# EAGLE design euro_psu (EAGLE 8.3.2)
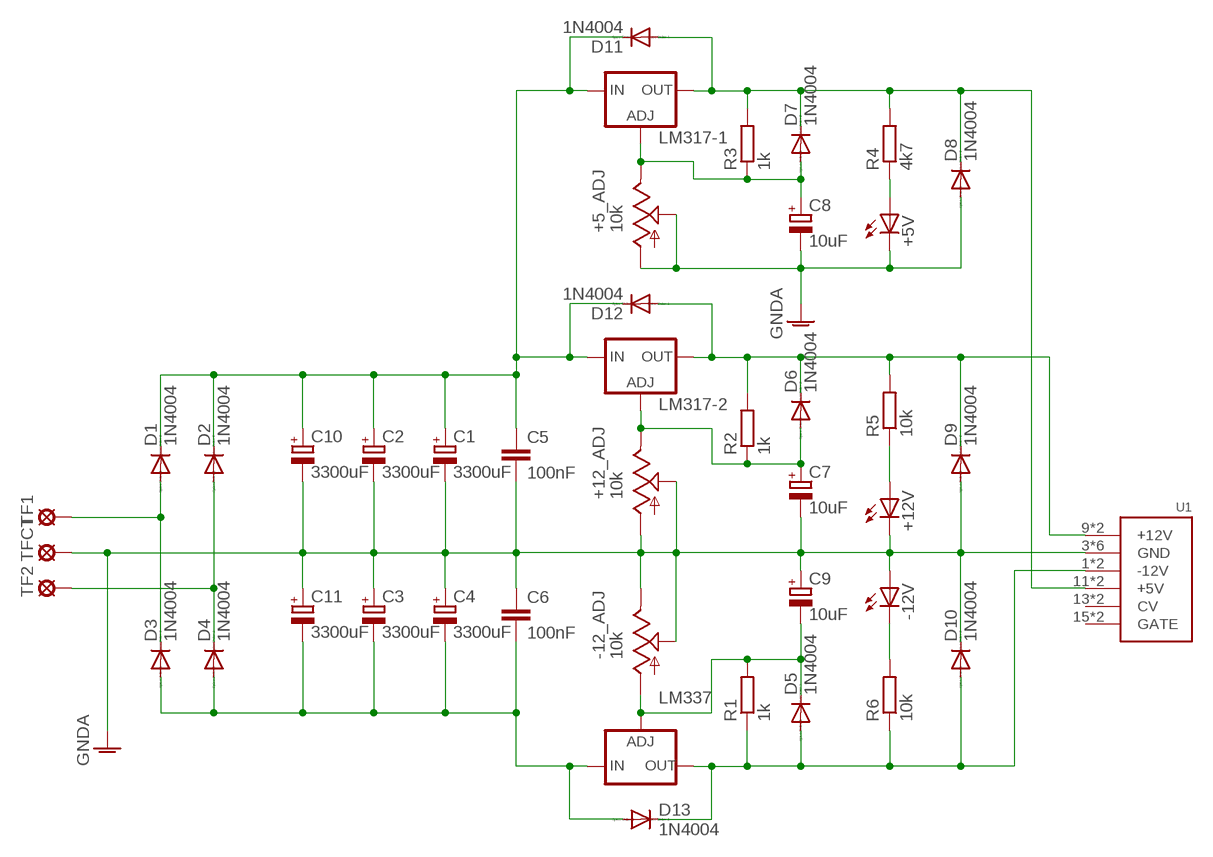
[diagram p0: schematic, sheet 1]

## Parts
+5_ADJ  10k  TRIM_US-B64W  [B64W]
+5V  LED5MM  [LED5MM]
+12_ADJ  10k  TRIM_US-B64W  [B64W]
+12V  LED5MM  [LED5MM]
-12_ADJ  10k  TRIM_US-B64W  [B64W]
-12V  LED5MM  [LED5MM]
C1  3300uF  CPOL-EUE7.5-16  [E7,5-16]
C2  3300uF  CPOL-EUE7.5-16  [E7,5-16]
C3  3300uF  CPOL-EUE7.5-16  [E7,5-16]
C4  3300uF  CPOL-EUE7.5-16  [E7,5-16]
C5  100nF  C-EU025-025X050  [C025-025X050]
C6  100nF  C-EU025-025X050  [C025-025X050]
C7  10uF  CPOL-EUB45181A  [B45181A]
C8  10uF  CPOL-EUB45181A  [B45181A]
C9  10uF  CPOL-EUB45181A  [B45181A]
C10  3300uF  CPOL-EUE7.5-16  [E7,5-16]
C11  3300uF  CPOL-EUE7.5-16  [E7,5-16]
D1  1N4004  [DO41-10]
D2  1N4004  [DO41-10]
D3  1N4004  [DO41-10]
D4  1N4004  [DO41-10]
D5  1N4004  [DO41-10]
D6  1N4004  [DO41-10]
D7  1N4004  [DO41-10]
D8  1N4004  [DO41-10]
D9  1N4004  [DO41-10]
D10  1N4004  [DO41-10]
D11  1N4004  [DO41-10]
D12  1N4004  [DO41-10]
D13  1N4004  [DO41-10]
LM317-1  LM317TS  [317TS]
LM317-2  LM317TS  [317TS]
LM337  LM337TS  [337TS]
R1  1k  R-EU_0207/10  [0207/10]
R2  1k  R-EU_0207/10  [0207/10]
R3  1k  R-EU_0207/10  [0207/10]
R4  4k7  R-EU_0207/10  [0207/10]
R5  10k  R-EU_0207/10  [0207/10]
R6  10k  R-EU_0207/10  [0207/10]
TF1  SE14  [SE14]
TF2  SE14  [SE14]
TFCT  SE14  [SE14]
U1  POWER  [POWER_16]

## Nets
GNDA: +5_ADJ.A +5_ADJ.P$1(S) +5_ADJ.S +5V.K(C) +12_ADJ.A +12_ADJ.P$1(S) +12_ADJ.S +12V.K(C) -12_ADJ.E -12_ADJ.P$1(S) -12_ADJ.S -12V.A C1.- C2.- C3.+ C4.+ C5.2 C6.1 C7.- C8.- C9.+ C10.- C11.+ D8.A D9.A D10.C TFCT.MP U1.3(GND) U1.4(GND) U1.5(GND) U1.6(GND) U1.7(GND) U1.8(GND)
N$1: D1.A D3.C TF1.MP
N$2: D2.A D4.C TF2.MP
N$3: C3.- C4.- C6.2 C11.- D3.A D4.A D13.A LM337.2(IN)
N$4: C1.+ C2.+ C5.1 C10.+ D1.C D2.C D11.C D12.C LM317-1.3(IN) LM317-2.3(IN)
N$5: -12_ADJ.A C9.- D5.C LM337.1(ADJ) R1.2
N$6: +12_ADJ.E C7.+ D6.A LM317-2.1(ADJ) R2.1
N$8: +5_ADJ.E C8.+ D7.A LM317-1.1(ADJ) R3.1
N$10: D5.A D10.A D13.C LM337.3(OUT) R1.1 R6.1 U1.1(-12V) U1.2(-12V)
N$11: D6.C D9.C D12.A LM317-2.2(OUT) R2.2 R5.2 U1.9(+12V) U1.10(+12V)
N$12: D7.C D8.C D11.A LM317-1.2(OUT) R3.2 R4.2 U1.11(+5V) U1.12(+5V)
N$21: +5V.A R4.1
N$24: -12V.K(C) R6.2
N$25: +12V.A R5.1
Unconnected: U1.13(CV) U1.14(CV) U1.15(GATE) U1.16(GATE)

## Library data of the parts
+5_ADJ +12_ADJ -12_ADJ = pot:TRIM_US-: POTENTIOMETER
+5V +12V -12V = led:LED: LED OSRAM: - CHIPLED LG R971, LG N971, LY N971, LG Q971, LY Q971, LO R971, LY R971 LH N974, LH R974 LS Q976, LO Q976, LY Q976 LO Q996 - Hyper CHIPLED LW Q18S LB Q993, LB Q99A, LB R99A - SideLED LS A670, LO A670, LY A670, LG A670, LP A670 LB A673, LV A673, LT A673, LW A673 LH A674 LY A675 LS A676, LA A676, LO A676, LY A676, LW A676 LS A679, LY A679, LG A679 - Hyper Micro SIDELED® LS Y876, LA Y876, LO Y876, LY Y876 LT Y87S - SmartLED LW L88C, LW L88S LB L89C, LB L89S, LG L890 LS L89K, LO L89K, LY L89K LS L896, LA L896, LO L896, LY L896 - TOPLED LS T670, LO T670, LY T670, LG T670, LP T670 LSG T670, LSP T670, LSY T670, LOP T670, LYG T670 LG T671, LOG T671, LSG T671 LB T673, LV T673, LT T673, LW T673 LH T674 LS T676, LA T676, LO T676, LY T676, LB T676, LH T676, LSB T676, LW T676 LB T67C, LV T67C, LT T67C, LS T67K, LO T67K, LY T67K, LW E67C LS E67B, LA E67B, LO E67B, LY E67B, LB E67C, LV E67C, LT E67C LW T67C LS T679, LY T679, LG T679 LS T770, LO T770, LY T770, LG T770, LP T770 LB T773, LV T773, LT T773, LW T773 LH T774 LS E675, LA E675, LY E675, LS T675 LS T776, LA T776, LO T776, LY T776, LB T776 LHGB T686 LT T68C, LB T68C - Hyper Mini TOPLED® LB M676 - Mini TOPLED Santana® LG M470 LS M47K, LO M47K, LY M47K Source: http://www.osram.convergy.de LUXEON: - LUMILED® LXK2-PW12-R00, LXK2-PW12-S00, LXK2-PW14-U00, LXK2-PW14-V00 LXK2-PM12-R00, LXK2-PM12-S00, LXK2-PM14-U00 LXK2-PE12-Q00, LXK2-PE12-R00, LXK2-PE12-S00, LXK2-PE14-T00, LXK2-PE14-U00 LXK2-PB12-K00, LXK2-PB12-L00, LXK2-PB12-M00, LXK2-PB14-N00, LXK2-PB14-P00, LXK2-PB14-Q00 LXK2-PR12-L00, LXK2-PR12-M00, LXK2-PR14-Q00, LXK2-PR14-R00 LXK2-PD12-Q00, LXK2-PD12-R00, LXK2-PD12-S00 LXK2-PH12-R00, LXK2-PH12-S00 LXK2-PL12-P00, LXK2-PL12-Q00, LXK2-PL12-R00 Source: www.luxeon.com KINGBRIGHT: KA-3528ASYC Source: www.kingbright.com
C1-C4 C7-C11 = rcl:CPOL-EU: POLARIZED CAPACITOR, European symbol
C5 C6 = rcl:C-EU: CAPACITOR, European symbol
D1-D13 = diode:1N4004: DIODE general purpose rectifier, 1 A
LM317-1 LM317-2 = v-reg:LM317TS: VOLTAGE REGULATOR
LM337 = v-reg:LM337TS: VOLTAGE REGULATOR
R1-R6 = rcl:R-EU_: RESISTOR, European symbol
TF1 TF2 TFCT = solpad:SE14: SOLDER PAD E1553, drill 1,4mm, distributor Buerklin, 07F820
U1 = eurorack:POWER

## Board
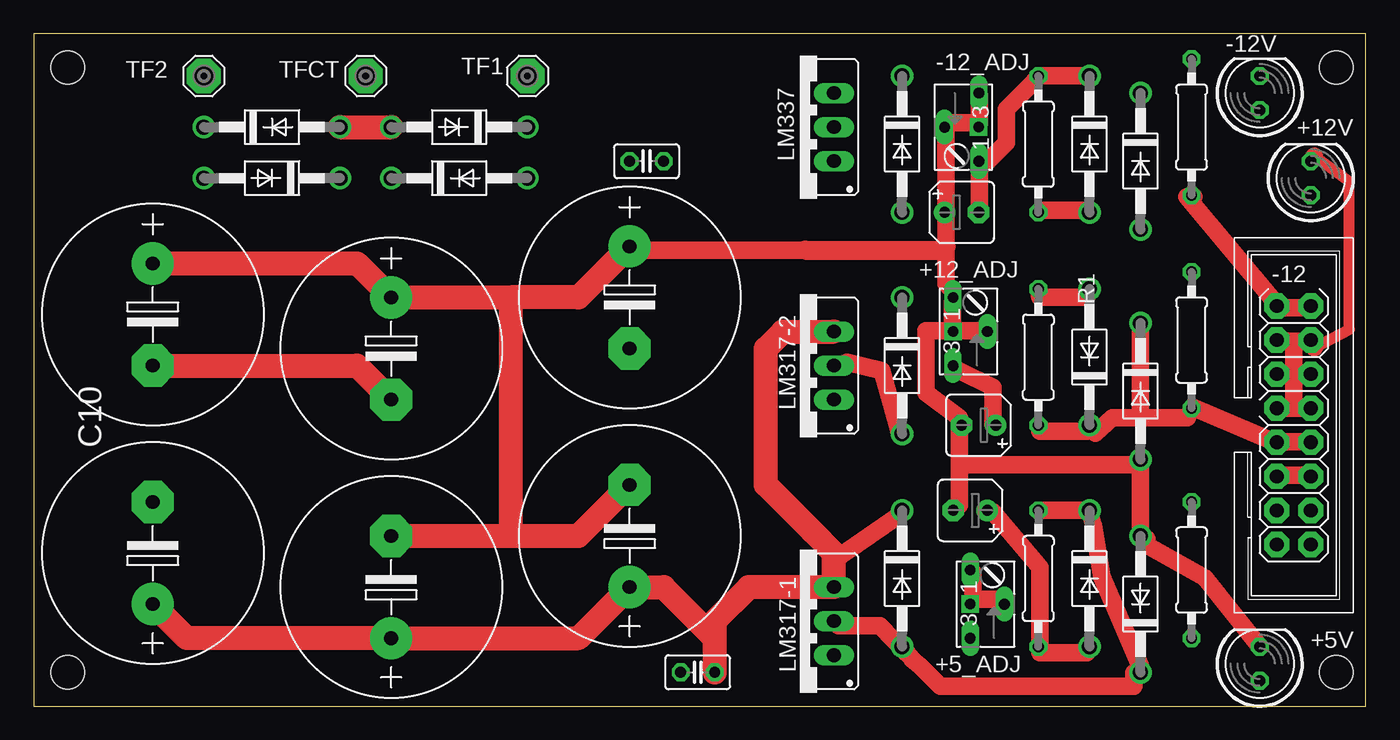
[diagram p1: board, top side]
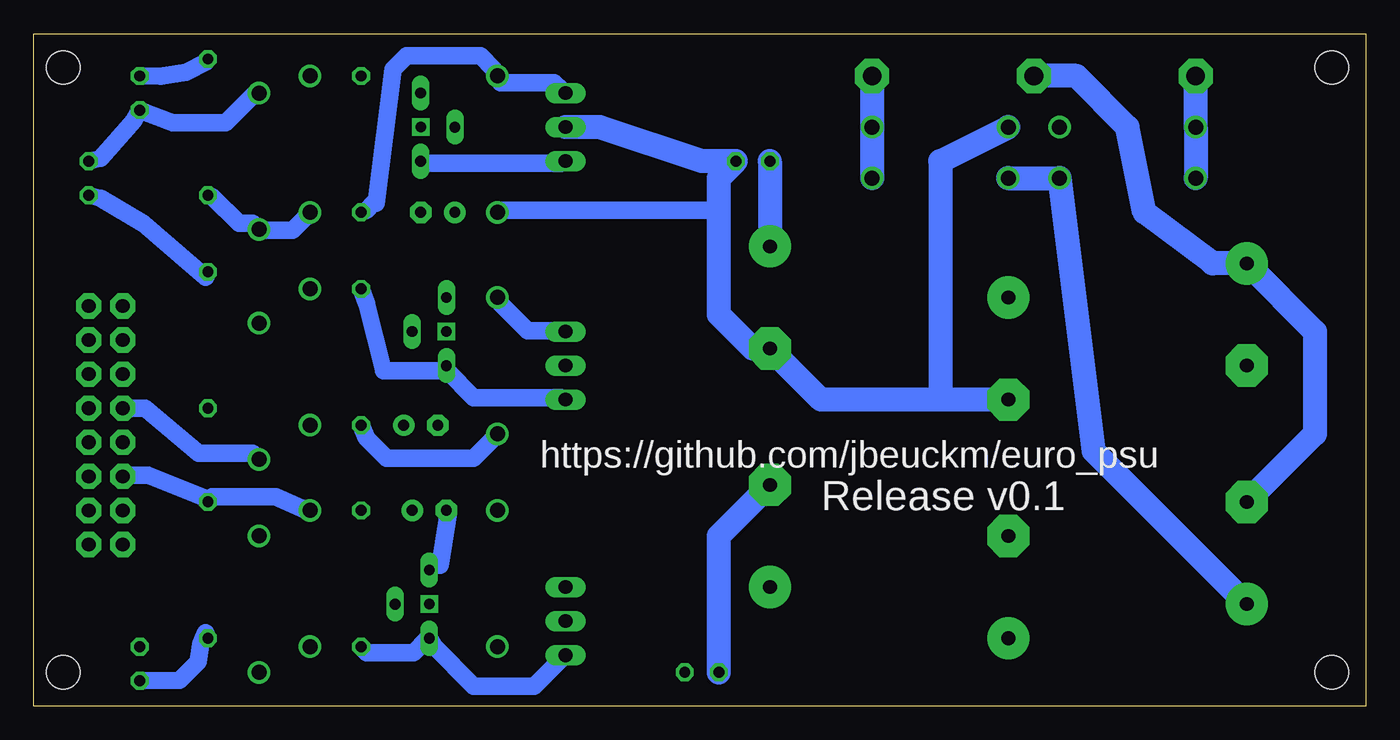
[diagram p2: board, bottom side, seen from below]

Size 99.36 x 50.16 mm. Coordinates in mm from the lower left corner, seen from the top.
Outline: 0,0 99.36,0 99.36,50.16 0,50.16 0,0
Copper layers (1*16): Top 0.035mm / dielectric 1.5mm / Bottom 0.035mm
Design rules "default *": minimum track width 52mil, minimum drill 24mil, track to track 24mil, track to pad 24mil, pad to pad 24mil, via to via 24mil, smd to smd 8mil, copper to edge 24mil, drill to drill 24mil, minimum pad ring 10mil, minimum via ring 8mil, stop-mask expansion 4mil, vias tented up to drill 0mil, thermal gap 10mil
Holes 2.5 mm at 2.54,47.62 2.54,2.54 97.16,47.62 97.16,2.54

### Footprints (pad centres in the part's own frame; a part is rotated, then mirrored left to right if it is on the bottom)
B64W = drill 0.813 long: A 2.54,0; E -2.54,0; S 0,-2.54 | drill 0.8 square: P$1 0,0
LED5MM = drill 0.813 octagon: A -1.27,0; K 1.27,0
E7,5-16 = drill 1.016 pad 3.15: + -3.81,0 | drill 1.016 pad 3.15 octagon: - 3.81,0
C025-025X050 = drill 0.813 octagon: 1 -1.27,0; 2 1.27,0
B45181A = drill 0.813 pad 1.6: + -1.27,0 | drill 0.813 pad 1.6 octagon: - 1.27,0
DO41-10 = drill 1.118: A 5.08,0; C -5.08,0
317TS = drill 1.016 long: 1 -2.54,-2.54; 2 0,-2.54; 3 2.54,-2.54
337TS = drill 1.016 long: 1 -2.54,-2.54; 2 0,-2.54; 3 2.54,-2.54
0207/10 = drill 0.813 octagon: 1 -5.08,0; 2 5.08,0
SE14 = drill 1.397 pad 2.54 octagon: MP 0,0
POWER_16 = drill 1.016 pad 1.88 octagon: 1 -6.35,-1.27; 2 -6.35,1.27; 3 -3.81,-1.27; 4 -3.81,1.27; 5 -1.27,-1.27; 6 -1.27,1.27; 7 1.27,-1.27; 8 1.27,1.27; 9 3.81,-1.27; 10 3.81,1.27; 11 6.35,-1.27; 12 6.35,1.27; 13 8.89,-1.27; 14 8.89,1.27; 15 11.43,-1.27; 16 11.43,1.27

### Placement (x,y rotation side)
+5_ADJ  69.85,7.62 90 top
+5V  91.44,3.17 90 top
+12_ADJ  68.58,27.94 90 top
+12V  95.25,39.37 90 top
-12_ADJ  70.48,43.18 270 top
-12V  91.44,45.72 90 top
C1  26.67,8.89 90 top
C2  44.45,12.7 90 top
C3  26.67,26.67 270 top
C4  44.45,30.48 270 top
C5  49.53,2.54 180 top
C6  45.72,40.64 0 top
C7  70.48,20.95 180 top
C8  69.85,14.61 180 top
C9  69.22,36.83 0 top
C10  8.89,11.43 90 top
C11  8.89,29.21 270 top
D1  31.75,39.37 0 top
D2  17.78,39.37 180 top
D3  31.75,43.18 180 top
D4  17.78,43.18 0 top
D5  78.74,41.91 270 top
D6  78.74,26.04 90 top
D7  78.74,9.53 270 top
D8  82.55,7.62 90 top
D9  82.55,23.5 270 top
D10  82.55,40.64 270 top
D11  64.77,9.53 270 top
D12  64.77,25.4 270 top
D13  64.77,41.91 270 top
LM317-1  57.15,6.35 90 top
LM317-2  57.15,25.4 90 top
LM337  57.15,43.18 90 top
R1  74.93,41.91 90 top
R2  74.93,26.04 270 top
R3  74.93,9.53 90 top
R4  86.36,10.16 90 top
R5  86.36,27.3 270 top
R6  86.36,43.18 90 top
TF1  36.83,46.99 0 top
TF2  12.7,46.99 0 top
TFCT  24.77,46.99 0 top
U1  93.98,23.5 270 top

### Tracks (layer width: path | path; a pad name or v marks a point on that pad's centre or on a via)
GNDA
  Top 0.813: 95.5,41 98.14,39.09 98.14,28.09 95.5,26.73
  Top 1.321: +12_ADJ.P$1 68.54,28 68.54,30 +12_ADJ.A 68.54,31 68.04,31.5 68.04,34.29 68.04,36.5 C9.+ 68.04,37 68.04,43 -12_ADJ.S 68.04,43.5 70.04,43.5 -12_ADJ.P$1 70.54,43.5 70.54,45.5 -12_ADJ.E | +12_ADJ.S 71.04,28 69.04,28 +12_ADJ.P$1 | 70.04,8 70.04,10 +5_ADJ.A | 70.04,8 +5_ADJ.P$1 | 70.04,8 72.04,8 +5_ADJ.S | 69.04,18 69.04,15 C8.- | 69.04,18 69.04,20.5 C7.- 69.04,21.5 66.54,23.36 66.54,28 68.04,28 +12_ADJ.P$1 | 94,27.23 95,27.23 U1.4 95.5,26.73 | 94,27.23 93,27.23 U1.3 | 94,22.23 95,22.23 U1.8 | 94,22.23 93,22.23 U1.7 | 94,24.73 95,24.73 U1.6 | 94,24.73 93,24.73 U1.5 | 94,24.73 94,22.23 | 94,24.73 94,27.23 | +5V.K 87.36,9.58 83.04,12 83.04,12.5 D8.A 82.54,13 82.54,17.73 | 82.54,17.73 82.54,18 69.04,18 | 82.54,17.73 D9.A | 95.5,41 +12V.K | 57.54,34 45,34 C4.+
  Top 1.422: 57.54,34 67.75,34 68.04,34.29
  Top 1.778: C11.+ 24.13,33.02 C3.+ 35.56,30.48 | C1.- 35.56,12.7 | 35.56,12.7 40.64,12.7 C2.- | C4.+ 40.64,30.48 35.56,30.48 | 35.56,30.48 35.56,12.7
  Bottom 1.321: +12V.K 94.36,40.87 92.14,43.41 91.91,43.63 -12V.A 89,43.5 85.04,43.5 83.04,45.5 D10.C | C8.- 68.41,14.5 69.04,10.5 69.54,10.5 +5_ADJ.A | U1.7 92.5,22.23 91.04,22.23 87.04,18.86 83.04,18.86 D9.A
  Bottom 1.778: TFCT.MP 21.59,46.99 17.78,43.18 16.51,36.83 11.43,33.02 C11.+ 3.81,27.94 3.81,20.32 C10.- | C6.1 C4.+ | C5.2 48.26,12.7 C2.-
N$1
  Bottom 1.778: D1.A D3.C TF1.MP
N$2
  Bottom 1.778: TF2.MP D4.C D2.A
N$3
  Top 1.778: D4.A D3.A | C11.- 24.13,25.4 C3.-
  Bottom 1.321: 48.26,37 64.54,37 D13.A
  Bottom 1.778: C3.- 31.75,22.86 | 31.75,22.86 40.64,22.86 C4.- 45.72,26.67 48.26,29.21 48.26,37 48.26,39.37 C6.2 49.53,40.64 57.15,43.18 LM337.2 | D3.A 31.75,40.64 31.75,22.86
N$4
  Top 1.321: D11.C 64.41,14.13 59.81,10.96 58.08,13.04
  Top 1.778: LM317-2.3 55.88,27.94 54.61,26.67 54.61,16.51 58.08,13.04 59.69,11.43 LM317-1.3 53.34,8.89 50.8,6.35 C5.1 50.8,5.08 46.99,8.89 C2.+ 40.64,5.08 C1.+ 11.43,5.08 C10.+
  Bottom 1.321: D12.C 64.54,30 62.54,28 60.04,28 LM317-2.3
  Bottom 1.778: C10.+ 20.32,19.05 D2.C D1.C
N$5
  Top 1.321: D5.C 78.54,47 75.04,47 R1.2 74.54,46.5 72.54,44.5 72.54,42 71.04,40.5 -12_ADJ.A 70.54,40.5 70.54,37 C9.-
  Bottom 1.321: LM337.1 60.04,40.5 70.04,40.5 -12_ADJ.A
N$6
  Top 1.321: R2.1 75.04,30.5 78.54,30.5 D6.A | +12_ADJ.E 69.04,25 71.54,23.77 71.54,21 C7.+
  Bottom 1.321: LM317-2.1 60.04,23 66.54,23 68.54,25 +12_ADJ.E 69.04,25 73.27,25 74.54,30 R2.1
N$8
  Top 1.321: 75.04,4 78.54,4 D7.A | 75.04,4 R3.1 | 75.04,4 75.04,10.37 71.54,14.5 C8.+
  Bottom 1.321: R3.1 74.54,4 71.04,4 70.04,5 +5_ADJ.E 69.54,4.5 66.54,1.5 62.04,1.5 60.04,3.5 LM317-1.1
N$10
  Top 1.321: U1.2 95,29.73 93,29.73 U1.1 92.5,30.23 86,38 86.54,38 R6.1 | R1.1 75.04,37 78.54,37 D5.A
  Bottom 1.321: LM337.3 60.04,46 60.54,46.5 64.54,46.5 D13.C 65.04,47.5 66.04,48.5 71.54,48.5 72.54,47.5 73.81,37.5 74.04,37.5 74.54,37 R1.1 | R6.1 86.04,38 84.04,36 83.04,36 D10.A 82.04,35.5 80.04,35.5 79.04,36.5 D5.A
N$11
  Top 1.321: LM317-2.2 60.67,25.64 63.27,25 64.54,20.5 D12.A | U1.10 95,19.73 93,19.73 U1.9 92.5,19.73 86.54,22.27 R5.2 86.04,21.5 82.54,21.5 | R2.2 75.04,20.5 78.54,20.5 D6.C 79.17,20.36 80.44,21.5 82.54,21.5 | 82.54,21.5 82.54,28.36 D9.C
  Bottom 1.321: D12.A 65.04,20 66.54,18.5 73.04,18.5 74.54,20 R2.2
N$12
  Top 1.321: U1.12 95,17.23 93,17.23 U1.11 | LM317-1.2 60.04,6 63.13,6 65.04,4 D11.A 65.54,3.5 65.5,3.5 66.14,3 67.64,1.5 82.04,1.5 82.04,2.5 D8.C 82.54,3 79.67,9.68 79.04,13.5 D7.C 78.54,14.63 75.04,14.63 R3.2
  Bottom 1.321: U1.11 92.5,17.23 90.81,17.23 86.54,15.5 R4.2 86.04,15.63 81.31,15.63 79.04,14.63 D7.C
N$21
  Bottom 1.321: R4.1 86.54,5.5 86.91,4.59 87.09,3.33 88.46,1.96 +5V.A
N$24
  Bottom 1.321: R6.2 86.54,48 87.98,47.27 89.89,46.95 -12V.K
N$25
  Bottom 1.321: R5.1 86.54,32 91.14,35.96 94.36,37.87 +12V.A

### Text on the board
bNames: https://github.com/jbeuckm/euro_psu | Release v0.1